# Altium schematic sheet 5Vto3V3_v1.0.SchDoc
size 71 x 45 mm
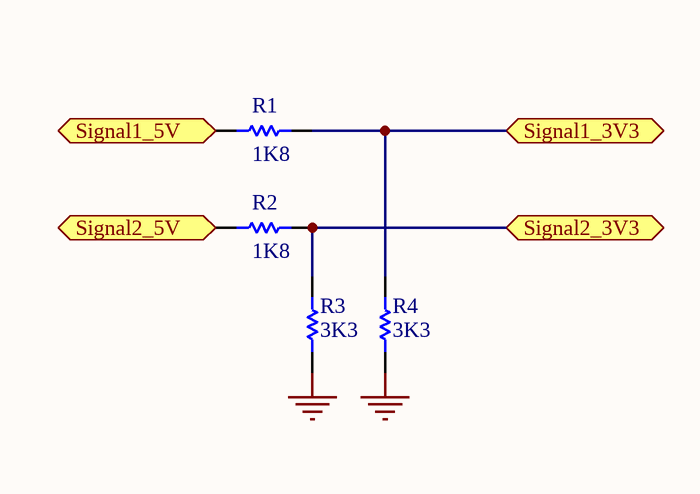
[diagram p0: 5Vto3V3_v1.0.SchDoc]

## Parts
R1  1K8  [SMD_0805]
R2  1K8  [SMD_0805]
R3  3K3  [SMD_0805]
R4  3K3  [SMD_0805]

## Ports
Signal1_3V3 (bidir), Signal1_5V (bidir), Signal2_3V3 (bidir), Signal2_5V (bidir)

## Nets
GND: R3.1 R4.1
Signal1_3V3: R1.2 R4.2 ; port Signal1_3V3
Signal1_5V: R1.1 ; port Signal1_5V
Signal2_3V3: R2.2 R3.2 ; port Signal2_3V3
Signal2_5V: R2.1 ; port Signal2_5V

## Library data of the parts
R1-R4 = Resistor: Resistor, 1/4W, 5%; Revision: July-2002: Re-released for DXP Platform.